# Altium schematic sheet Overview.SchDoc: Example Template
size A4; CompanyName: University of Manchester; Engineer: Sam Walsh; Organization: University of Manchester; Address1: L3, 12a Rodborough Rd; Address2: Frenchs Forest; Address3: NSW; Address4: Australia 2086; DocumentNumber: 1; Revision: 0; SheetNumber: 1; SheetTotal: 8; Scale: Ratio
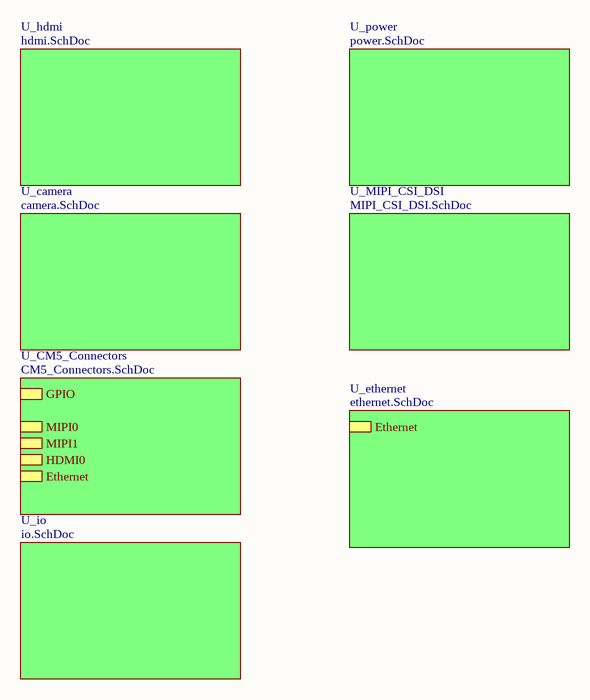
[diagram p0: Overview.SchDoc]

## Sub-sheets
U_camera = camera.SchDoc: no entries
U_CM5_Connectors = CM5_Connectors.SchDoc: GPIO, MIPI0 (harness MIPI0), MIPI1 (harness MIPI1), HDMI0 (harness HDMI0), Ethernet (harness Ethernet)
U_ethernet = ethernet.SchDoc: Ethernet (harness Ethernet)
U_hdmi = hdmi.SchDoc: no entries
U_io = io.SchDoc: no entries
U_MIPI_CSI_DSI = MIPI_CSI_DSI.SchDoc: no entries
U_power = power.SchDoc: no entries

## Notes on the sheet
- Size:
- Title
- A4
- Scale:
- NTS
- Revision:
- Designer
- Date:
- Sheet
- of